# EAGLE design m328p_rfm69_node (EAGLE 7.2.0)
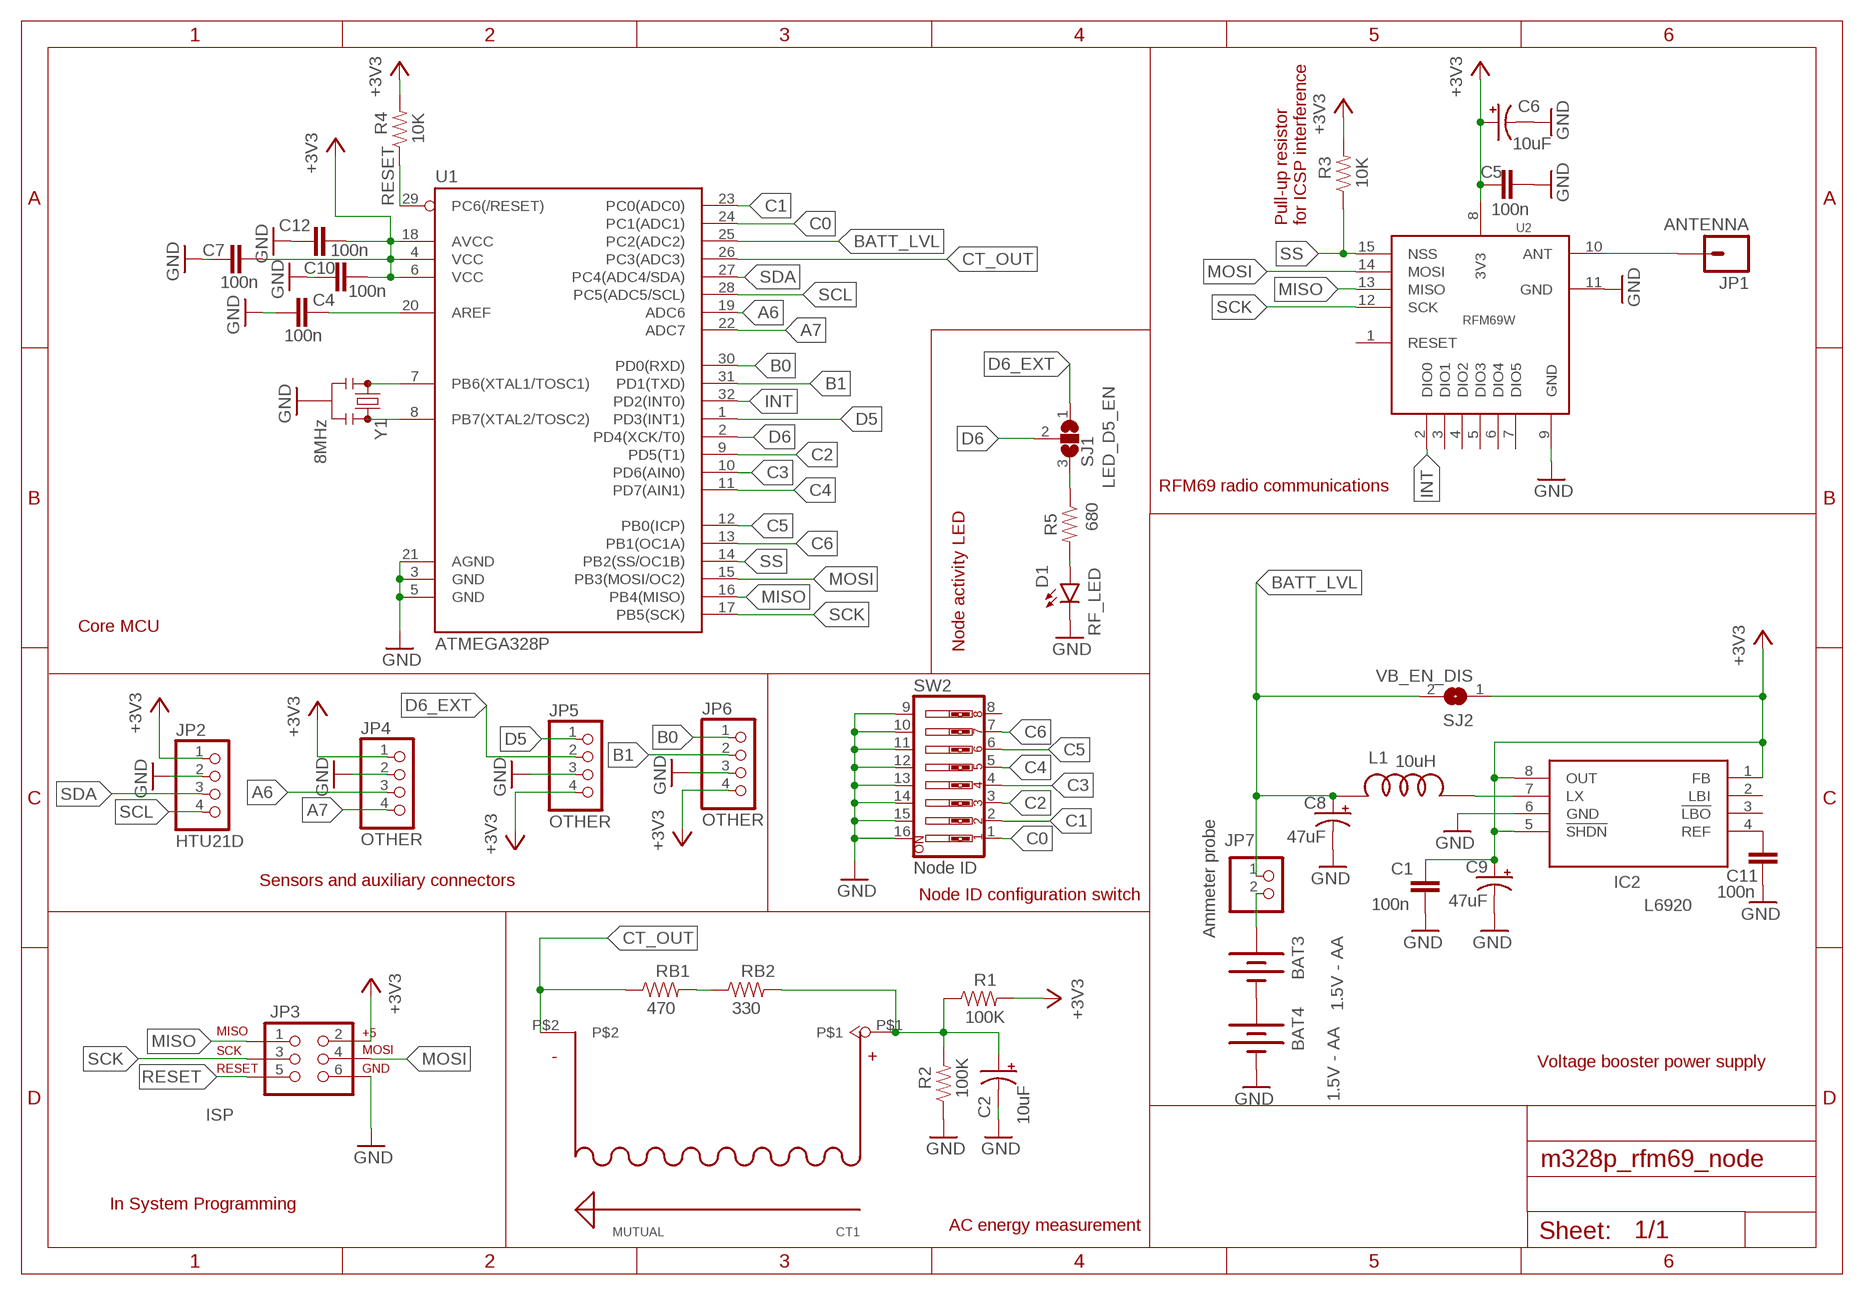
[diagram p0: schematic, sheet 1]

## Parts
BAT3  1.5V - AA  BATTERYAAA-KIT  [BATTERY-AAA-KIT]
BAT4  1.5V - AA  BATTERYAAA-KIT  [BATTERY-AAA-KIT]
C1  100n  CAP0805  [0805]
C2  10uF  47UF-TANT  [EIA3528]
C4  100n  CAP0805  [0805]
C5  100n  CAP0805  [0805]
C6  10uF  47UF-TANT  [EIA3528]
C7  100n  CAP0805  [0805]
C8  47uF  47UF-TANT  [EIA3528]
C9  47uF  47UF-TANT  [EIA3528]
C10  100n  CAP0805  [0805]
C11  100n  CAP0805  [0805]
C12  100n  CAP0805  [0805]
CT1  MUTUAL  [MUTUAL]
D1  RF_LED  LED0603  [LED-0603]
IC2  L6920  L6920TSSOP8  [TSSOP8]
JP1  ANTENNA  M01SMD  [LUXEON-PAD]
JP2  HTU21D  PINHD-1X4  [1X04]
JP3  ISP  AVR_SPI_PRG_6PTH  [2X3]
JP4  OTHER  PINHD-1X4  [1X04]
JP5  OTHER  PINHD-1X4  [1X04]
JP6  OTHER  PINHD-1X4  [1X04]
JP7  Ammeter probe  PINHD-1X2  [1X02]
L1  10uH  DLJ-4018  [DLJ-4018]
R1  100K  RESISTOR0805-RES  [0805]
R2  100K  RESISTOR0805-RES  [0805]
R3  10K  RESISTOR0805-RES  [0805]
R4  10K  RESISTOR0805-RES  [0805]
R5  680  RESISTOR0805-RES  [0805]
RB1  470  RESISTOR0805-RES  [0805]
RB2  330  RESISTOR0805-RES  [0805]
SJ1  LED_D5_EN  SJ2W  [SJ_2]
SJ2  VB_EN_DIS  SJ  [SJ]
SW2  Node ID  SW_DIP-8-SMT-HALFSIZE  [DIPSWITCH-08-50MIL]
U1  ATMEGA328P  ATMEGA328P_TQFP  [TQFP32-08]
U2  RFM69W  [RFM69W]
Y1  8MHz  RESONATOR4MHZ  [RESONATOR-SMD_MED]

## Nets
+3V3: C1.1 C5.1 C6.A(+) C7.2 C9.A(+) C10.2 C12.2 IC2.1(FB) IC2.5(!SHDN) IC2.8(OUT) JP2.1 JP3.2 JP4.1 JP5.4 JP6.4 R1.2 R3.2 R4.2 SJ2.1 U1.4(VCC) U1.6(VCC) U1.18(AVCC) U2.8(3V3)
A6: JP4.3 U1.19(ADC6)
A7: JP4.4 U1.22(ADC7)
B0: JP6.1 U1.30(PD0(RXD))
B1: JP6.2 U1.31(PD1(TXD))
BATT_LVL: C8.A(+) JP7.1 L1.P$2 SJ2.2 U1.25(PC2(ADC2))
C0: SW2.1 U1.24(PC1(ADC1))
C1: SW2.2 U1.23(PC0(ADC0))
C2: SW2.3 U1.9(PD5(T1))
C3: SW2.4 U1.10(PD6(AIN0))
C4: SW2.5 U1.11(PD7(AIN1))
C5: SW2.6 U1.12(PB0(ICP))
C6: SW2.7 U1.13(PB1(OC1A))
CT_OUT: CT1.P$2 RB1.1 U1.26(PC3(ADC3))
D5: JP5.1 U1.1(PD3(INT1))
D6: SJ1.2 U1.2(PD4(XCK/T0))
D6_EXT: JP5.2 SJ1.1
GND: BAT4.GND@1(-) C1.2 C2.C(-) C4.1 C5.2 C6.C(-) C7.1 C8.C(-) C9.C(-) C10.1 C11.2 C12.1 D1.C IC2.6(GND) JP2.2 JP3.6 JP4.2 JP5.3 JP6.3 R2.1 SW2.9 SW2.10 SW2.11 SW2.12 SW2.13 SW2.14 SW2.15 SW2.16 U1.3(GND) U1.5(GND) U1.21(AGND) U2.9(GND) U2.11(GND) Y1.2
INT: U1.32(PD2(INT0)) U2.2(DIO0)
MISO: JP3.1 U1.16(PB4(MISO)) U2.13(MISO)
MOSI: JP3.4 U1.15(PB3(MOSI/OC2)) U2.14(MOSI)
N$1: IC2.7(LX) L1.P$1
N$2: D1.A R5.2
N$3: RB1.2 RB2.1
N$4: C11.1 IC2.4(REF)
N$5: BAT3.PWR@1(+) JP7.2
N$6: U1.8(PB7(XTAL2/TOSC2)) Y1.3
N$8: BAT3.GND@1(-) BAT4.PWR@1(+)
N$9: U1.7(PB6(XTAL1/TOSC1)) Y1.1
N$10: JP1.P$1 U2.10(ANT)
N$11: C2.A(+) CT1.P$1 R1.1 R2.2 RB2.2
N$12: C4.2 U1.20(AREF)
N$13: R5.1 SJ1.3
RESET: JP3.5 R4.1 U1.29(PC6(/RESET))
SCK: JP3.3 U1.17(PB5(SCK)) U2.12(SCK)
SCL: JP2.4 U1.28(PC5(ADC5/SCL))
SDA: JP2.3 U1.27(PC4(ADC4/SDA))
SS: R3.1 U1.14(PB2(SS/OC1B)) U2.15(NSS)
Unconnected: IC2.2(LBI) IC2.3(!LBO) SW2.8 U2.1(RESET) U2.3(DIO1) U2.4(DIO2) U2.5(DIO3) U2.6(DIO4) U2.7(DIO5)

## Notes on the sheet
- Pull-up resistor
  for ICSP interference
- RFM69 radio communications
- Core MCU
- Node activity LED
- Sensors and auxiliary connectors
- Node ID configuration switch
- Voltage booster power supply
- In System Programming
- AC energy measurement

## Library data of the parts
BAT3 BAT4 = SparkFun-Electromechanical:BATTERY: Battery Holders Various common sizes : AA, AAA, 18650 (PRT-12895), 20mm coin cell and 12mm coin cell. 20MM_4LEGS, BATT-10373; PROD_ID: BATT-08571
C1 C4 C5 C7 C10-C12 = SparkFun-Capacitors:CAP: Capacitor Standard 0603 ceramic capacitor, and 0.1" leaded capacitor.
C2 C6 = SparkFun-Capacitors:47UF-TANT: 47uF Tantalum SMT CAP-08310- 10V 10% (EIA-3528); PROD_ID: CAP-08310; VALUE: 47uF
C8 C9 = SparkFun-Capacitors:47UF-TANT: 47uF Tantalum SMT CAP-08310- 10V 10% (EIA-3528); PROD_ID: CAP-08310
CT1 = Electricity_sensor:MUTUAL
D1 = SparkFun-LED:LED: LEDs Standard schematic elements and footprints for 5mm, 3mm, 1206, and 0603 sized LEDs. 5mm - Spark Fun Electronics SKU : COM-00529 (and others)
IC2 = l6920:L6920
JP1 = SparkFun-Connectors:M01: Header 1 Standard 1-pin 0.1" header. Use with straight break away headers (SKU : PRT-00116), right angle break away headers (PRT-00553), swiss pins (PRT-00743), machine pins (PRT-00117), and female headers (PRT-00115).
JP2 JP4-JP6 = pinhead:PINHD-1X4: PIN HEADER
JP3 = SparkFun-Connectors:AVR_SPI_PRG_6: AVR ISP 6 Pin This is the reduced ISP connector for AVR programming. Common on Arduino. This footprint will take up less PCB space and can be used with a 10-pin to 6-pin adapter such as SKU: BOB-08508 **Special note about "TEST_POINT" package. The stop mask is on the top side, so if you want your programming test points to be on the bottom of your board, make sure to place this package on the bottom side of the board. This also ensure that the orientation to program from the bottom side will be correct.
JP7 = pinhead:PINHD-1X2: PIN HEADER
L1 = dlj-4018:DLJ-4018
R1-R4 RB1 RB2 = SparkFun-Resistors:RESISTOR: Resistor Basic schematic elements and footprints for 0603, 1206, and PTH resistors.
R5 = SparkFun-Passives:RESISTOR: Resistor Basic schematic elements and footprints for 0603, 1206, and PTH resistors.
SJ1 = jumper:SJ2W: SMD solder JUMPER
SJ2 = jumper:SJ: SMD solder JUMPER
SW2 = SparkFun-Electromechanical:SW_DIP-8: DIP Switch 8 Position
U1 = SparkFun-DigitalIC:ATMEGA328P_TQFP; PROD_ID: IC-09069; VALUE: ATMEGA328P_TQFP
U2 = rfm69w:RFM69W: Radio Transceiver Module, FSK, 433, 848, 915 MHz, SPI controlled, Mfr=HopeRF
Y1 = SparkFun-FreqCtrl:RESONATOR: Resonator Small SMD resonator. Used, eg, on the Arduino Pro/ Pro Mini boards. 8MHz- XTAL-08895 16MHz- XTAL-08900; PROD_ID: XTAL-12492; VALUE: 4MHz

## Board
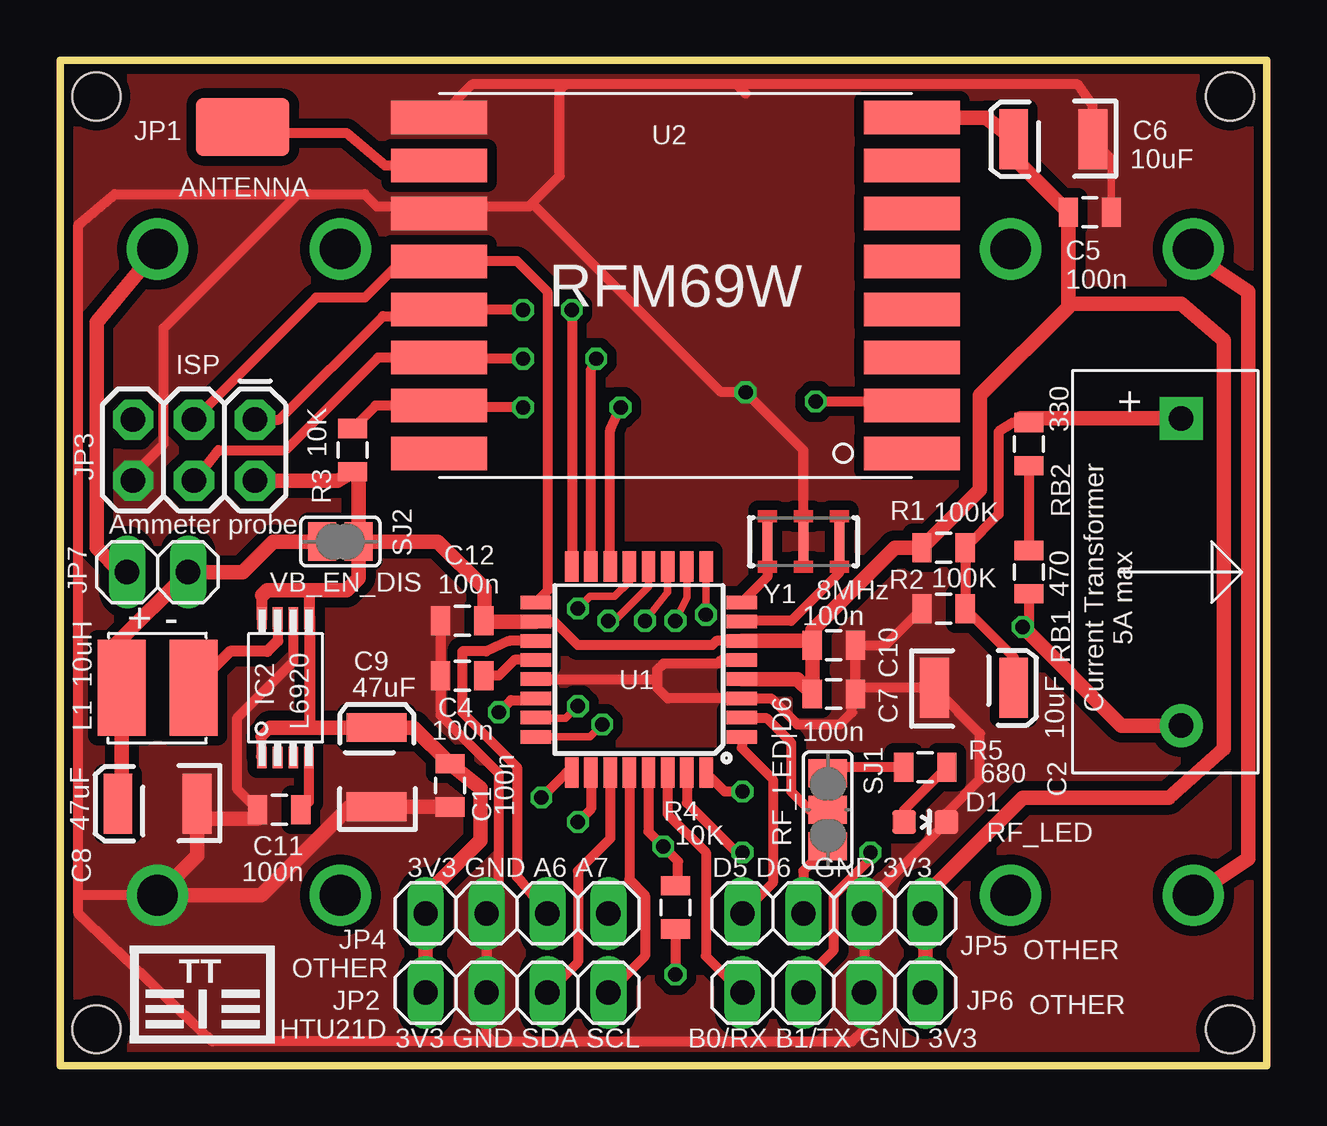
[diagram p1: board, top side]
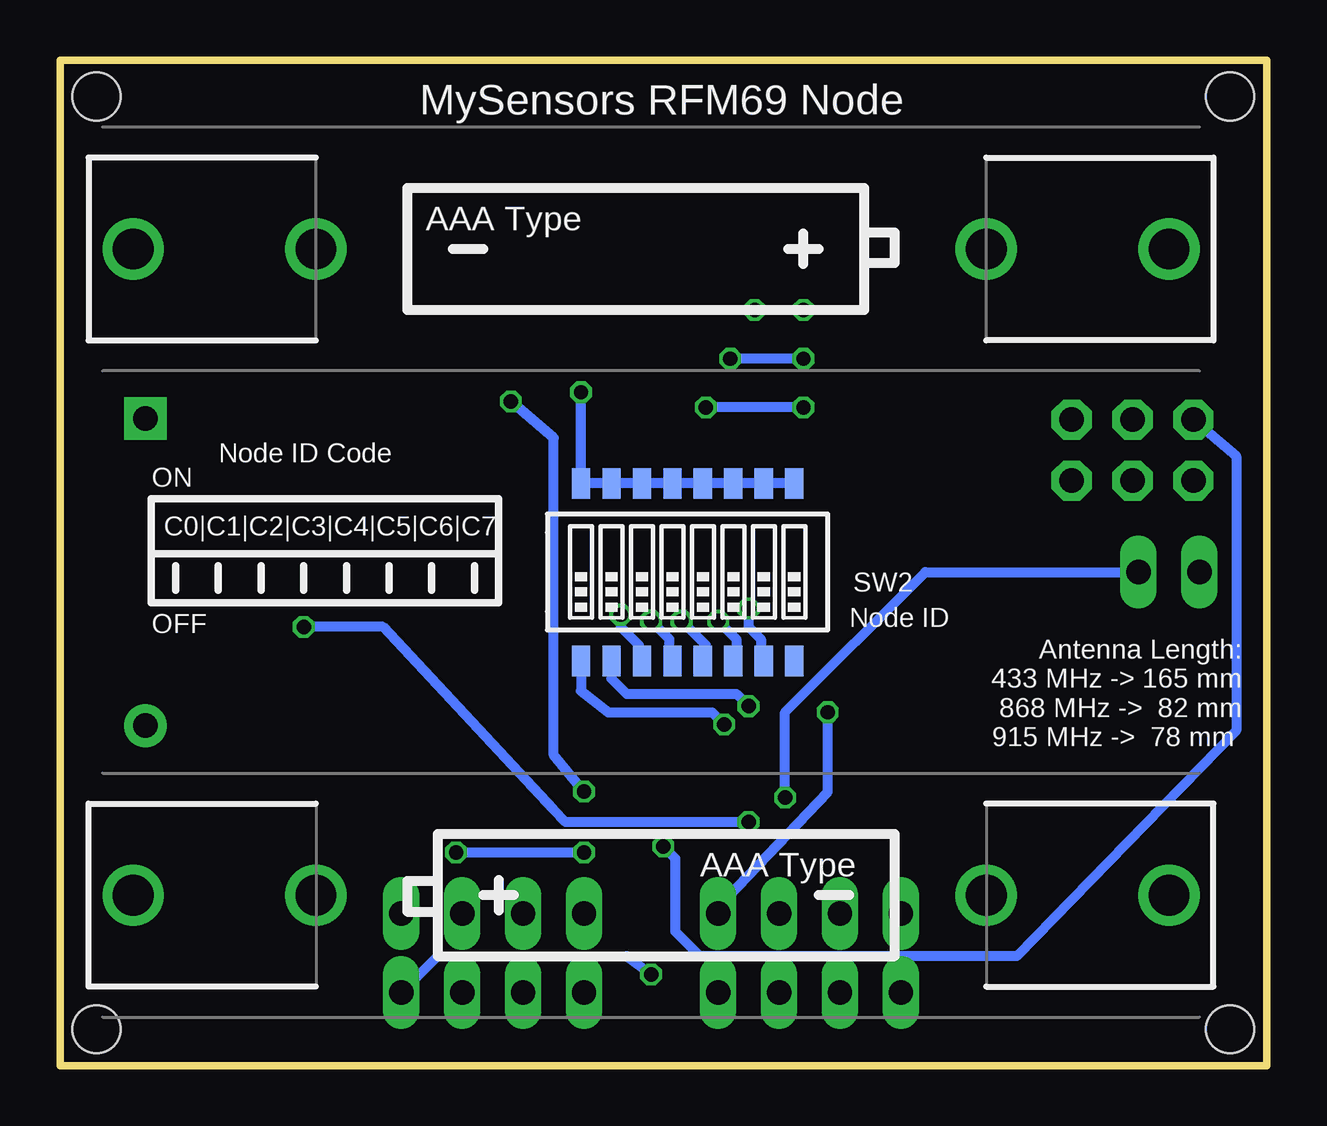
[diagram p2: board, bottom side, seen from below]

Size 50.29 x 41.91 mm. Coordinates in mm from the lower left corner, seen from the top.
Outline: 0,41.91 50.29,41.91 50.29,0 0,0 0,41.91
Copper layers (1*16): Top 0.035mm / dielectric 1.5mm / Bottom 0.035mm
Design rules "ITEADstudio_DRC *": minimum track width 6mil, minimum drill 12mil, track to track 6mil, track to pad 6mil, pad to pad 6mil, via to via 6mil, smd to smd 0mil, copper to edge 10mil, drill to drill 10mil, minimum pad ring 10mil, minimum via ring 6mil, stop-mask expansion 2mil, vias tented up to drill 100mil, thermal gap 10mil
Holes 2 mm at 1.52,40.39 1.52,1.52 48.77,1.52 48.77,40.39

### Footprints (pad centres in the part's own frame; a part is rotated, then mirrored left to right if it is on the bottom)
BATTERY-AAA-KIT = drill 1.702: GND@1 21.59,0; GND@2 13.97,0; PWR@1 -21.59,0; PWR@2 -13.97,0
0805 = smd 0.8 x 1.2: 1 -0.9,0; 2 0.9,0
EIA3528 = smd 1.2 x 2.5: A 1.65,0; C -1.65,0
MUTUAL = drill 1.016 pad 1.778 square: P$1 -6.4,0 | drill 1.016 pad 1.778: P$2 6.4,0
LED-0603 = smd 1 x 1: A 0,-0.877; C 0,0.877
TSSOP8 = smd 0.4 x 0.9: 1 -0.975,-2.9; 2 -0.325,-2.9; 3 0.325,-2.9; 4 0.975,-2.9; 5 0.975,2.9; 6 0.325,2.9; 7 -0.325,2.9; 8 -0.975,2.9
LUXEON-PAD = smd 3.9 x 2.4: P$1 0,0
1X04 = drill 1.016 long: 1 -3.81,0; 2 -1.27,0; 3 1.27,0; 4 3.81,0
2X3 = drill 1.016 pad 1.676 octagon: 1 -2.54,-1.27; 2 -2.54,1.27; 3 0,-1.27; 4 0,1.27; 5 2.54,-1.27; 6 2.54,1.27
1X02 = drill 1.016 long: 1 -1.27,0; 2 1.27,0
DLJ-4018 = smd 4 x 2: P$1 0,-1.5; P$2 0,1.5
SJ_2 = smd 1.168 x 1.6: 1 -1.524,0; 2 0,0; 3 1.524,0
SJ = smd 1.168 x 1.6: 1 -0.762,0; 2 0.762,0
DIPSWITCH-08-50MIL = smd 0.762 x 1.27: 1 -4.445,-3.7; 2 -3.175,-3.7; 3 -1.905,-3.7; 4 -0.635,-3.7; 5 0.635,-3.7; 6 1.905,-3.7; 7 3.175,-3.7; 8 4.445,-3.7; 9 4.445,3.7; 10 3.175,3.7; 11 1.905,3.7; 12 0.635,3.7; 13 -0.635,3.7; 14 -1.905,3.7; 15 -3.175,3.7; 16 -4.445,3.7
TQFP32-08 = smd 1.27 x 0.559: 1 -4.293,2.8; 2 -4.293,2; 3 -4.293,1.2; 4 -4.293,0.4; 5 -4.293,-0.4; 6 -4.293,-1.2; 7 -4.293,-2; 8 -4.293,-2.8; 17 4.293,-2.8; 18 4.293,-2; 19 4.293,-1.2; 20 4.293,-0.4; 21 4.293,0.4; 22 4.293,1.2; 23 4.293,2; 24 4.293,2.8 | smd 0.559 x 1.27: 9 -2.8,-4.293; 10 -2,-4.293; 11 -1.2,-4.293; 12 -0.4,-4.293; 13 0.4,-4.293; 14 1.2,-4.293; 15 2,-4.293; 16 2.8,-4.293; 25 2.8,4.293; 26 2,4.293; 27 1.2,4.293; 28 0.4,4.293; 29 -0.4,4.293; 30 -1.2,4.293; 31 -2,4.293; 32 -2.8,4.293
RFM69W = smd 4 x 1.4: 1 -9.85,7; 2 -9.85,5; 3 -9.85,3; 4 -9.85,1; 5 -9.85,-1; 6 -9.85,-3; 7 -9.85,-5; 8 -9.85,-7; 9 9.85,-7; 10 9.85,-5; 11 9.85,-3; 12 9.85,-1; 13 9.85,1; 14 9.85,3; 15 9.85,5; 16 9.85,7
RESONATOR-SMD_MED = smd 0.4 x 1.6: 1 -1.5,0; 2 0,0; 3 1.5,0

### Placement (x,y rotation side)
BAT3  25.65,34.04 180 bottom
BAT4  25.65,7.11 0 bottom
C1  16.26,11.68 270 top
C2  38.1,15.75 0 top
C4  16.76,16.26 0 top
C5  42.93,35.56 0 top
C6  41.4,38.61 180 top
C7  32.26,15.49 180 top
C8  4.06,10.92 180 top
C9  13.21,12.45 90 top
C10  32.26,17.53 180 top
C11  9.14,10.67 180 top
C12  16.76,18.54 0 top
CT1  46.74,20.57 270 top
D1  36.07,10.16 270 top
IC2  9.4,15.75 0 top
JP1  7.62,39.12 0 top
JP2  19.05,3.05 0 top
JP3  5.59,25.65 180 top
JP4  19.05,6.35 0 top
JP5  32.26,6.35 0 top
JP6  32.26,3.05 0 top
JP7  4.06,20.57 180 top
L1  4.06,15.75 90 top
R1  36.83,21.59 180 top
R2  36.83,19.05 0 top
R3  12.19,25.65 270 top
R4  25.65,6.6 270 top
R5  36.07,12.45 0 top
RB1  40.39,20.57 90 top
RB2  40.39,25.91 90 top
SJ1  32,10.67 90 top
SJ2  11.68,21.84 180 top
SW2  24.13,20.57 0 bottom
U1  24.13,16.51 180 top
U2  25.65,32.51 180 top
Y1  30.99,21.84 180 top

### Tracks (layer width: path | path; a pad name or v marks a point on that pad's centre or on a via)
+3V3  (via drill 0.6)
  Top 0.305: 17.7,18.51 C12.2 | 8.38,12.89 IC2.1 | 12.45,24.5 R3.2 | 10.41,14.35 10.16,14.1 | 10.41,18.69 IC2.5 | 31.36,18.15 C10.2 31.17,17.71 | 42.16,31.75 42.03,31.61
  Top 0.406: 8.38,13.72 8.38,12.89 | R4.2 v25.65,3.81 | U1.6 27.36,17.71 27.18,17.53 21.59,17.53 20.61,18.51 U1.18
  Top 0.457: 8.76,14.1 8.38,13.72 | IC2.8 8.42,19.6 | 10.41,14.35 10.41,18.69 10.41,19.81
  Top 0.61: U1.18 17.7,18.51 17.7,19.9 15.75,21.84 SJ2.1 | U1.4 30.74,16.11 C7.2 C10.2 | 8.76,14.1 10.16,14.1 C9.A 14.74,14.1 C1.1 17.53,11.57 17.53,9.4 15.24,7.11 JP4.1 JP2.1 | 8.42,19.6 8.64,19.81 10.41,19.81 11.94,19.81 12.45,20.32 SJ2.1 | SJ2.1 12.45,24.5 | JP3.2 11.57,24.38 R3.2 | 31.36,18.15 34.8,21.59 R1.2 38.35,24.01 38.35,27.94 42.03,31.61 C5.1 39.75,37.83 C6.A 38.59,39.51 U2.8 | 42.16,31.75 46.74,31.75 48.51,30.23 48.51,13.21 46.23,11.18 40.13,11.18 36.07,7.11 JP5.4 JP6.4 | U1.6 31.17,17.71
  Bottom 0.406: JP6.4 34.54,4.57 26.67,4.57 v25.65,3.81
A6
  Top 0.406: JP4.3 19.05,7.87 19.05,12.45 16.76,14.73 16.76,17.27 17.78,17.27 18.73,17.71 U1.19
A7  (via drill 0.6)
  Top 0.305: 19.77,15.24 U1.22
  Top 0.406: v18.29,14.73 18.8,15.24 19.77,15.24
  Bottom 0.406: JP4.4 22.86,6.6 18.29,11.43 v18.29,14.73
B0
  Top 0.406: JP6.1 26.92,4.57 26.92,8.89 25.33,10.48 U1.30
B1  (via drill 0.6)
  Top 0.406: U1.31 26.13,10.95 28.19,8.89 v28.45,8.89 28.45,9.14 | JP6.2 30.99,3.56 32.26,4.83 32.26,7.11 33.78,8.64 v33.78,8.89
  Bottom 0.406: v33.78,8.89 v28.45,8.89
BATT_LVL  (via drill 0.6)
  Top 0.406: U1.25 21.11,12.22 v20.07,11.18
  Top 0.61: SJ2.2 8.89,21.84 7.62,20.57 JP7.1 2.31,17.55 L1.P$2 2.56,11.07 C8.A 2.31,11.07
  Bottom 0.406: v20.07,11.18 20.07,14.73 14.22,20.57 JP7.1
C0  (via drill 0.6)
  Top 0.305: U1.24 22.1,13.72 v22.61,14.22
  Bottom 0.406: SW2.1 28.57,15.62 27.43,14.73 23.11,14.73 v22.61,14.22
C1  (via drill 0.6)
  Top 0.305: U1.23 19.87,14.48 21.08,14.48 v21.59,14.99
  Bottom 0.406: SW2.2 27.3,16.13 26.67,15.49 22.1,15.49 v21.59,14.99
C2  (via drill 0.6)
  Top 0.305: U1.9 26.93,19.06 v26.92,18.8
  Bottom 0.305: 26.16,17 SW2.3
  Bottom 0.406: v26.92,18.8 26.92,18.29 26.16,17.53 26.16,17
C3  (via drill 0.6)
  Top 0.305: U1.10 26.13,19.53 v25.65,18.54
  Bottom 0.305: 24.89,17 SW2.4
  Bottom 0.406: 24.89,17 24.89,17.78 v25.65,18.54
C4  (via drill 0.6)
  Top 0.305: U1.11 25.33,19.74 v24.38,18.54
  Bottom 0.305: 23.37,17 SW2.5
  Bottom 0.406: 23.37,17 23.37,17.53 v24.38,18.54
C5  (via drill 0.6)
  Top 0.305: U1.12 24.53,19.96 23.11,18.54 v22.86,18.54
  Bottom 0.305: 22.1,17 SW2.6
  Bottom 0.406: v22.86,18.54 22.1,17.78 22.1,17
C6  (via drill 0.6)
  Top 0.305: U1.13 23.73,20.17 23.11,19.56 22.1,19.56 v21.59,19.05
  Bottom 0.305: 21.08,17 SW2.7
  Bottom 0.406: v21.59,19.05 21.59,18.29 21.08,17.78 21.08,17
CT_OUT  (via drill 0.6)
  Top 0.305: 40.39,18.54 v40.13,18.29
  Top 0.406: U1.26 22.13,10.7 v21.59,10.16 | RB1.1 40.39,18.54
  Top 0.61: CT1.P$2 44.25,14.17 v40.13,18.29
  Bottom 0.406: v40.13,18.29 36.83,18.29 29.72,10.67 29.21,10.16 v21.59,10.16
D5
  Top 0.406: U1.1 28.42,13.23 29.72,11.94 29.72,7.62 JP5.1
D6
  Top 0.406: SJ1.2 31.24,10.67 30.48,11.43 30.48,13.46 29.46,14.48 28.45,14.48 U1.2
D6_EXT
  Top 0.406: SJ1.1 30.99,8.13 JP5.2
GND  (via drill 0.6)
  Top 0.254: JP3.6 3.05,24.64 | 9.91,36.32 10.41,36.32
  Top 0.305: 15.76,10.8 C1.2 | C11.2 8.24,10.3 | 14.74,35.81 U2.11 16.01,35.81 | 24.78,16.11 24.89,16 | D1.C 36.95,10.53 | 33.41,15.75 C7.1 33.02,15.36 | C5.2 43.83,37.83 C6.C
  Top 0.406: C12.1 C4.1 15.86,14.62 18.29,12.19 18.29,6.86 JP4.2 JP2.2 17.78,1.27 18.03,1.02 | C7.1 C10.1 34.41,17.53 R2.1 | IC2.6 9.72,16.84 7.37,14.48 7.37,11.55 C11.2 | 14.74,35.81 13.21,35.81 12.7,36.32 10.41,36.32 2.29,36.32 0.76,35.05 0.76,7.11 | U1.21 24.78,16.11 | D1.C 33.53,6.74 JP5.3 JP6.3 33.53,1.52 33.02,1.02 18.03,1.02 | 36.95,10.53 38.35,11.94 38.35,13.84 C2.C 33.41,15.75 | 33.02,15.36 33.02,14.73 32.51,14.22 30.73,14.22 29.65,15.31 U1.3 25.33,15.31 24.89,15.75 24.89,16 24.89,16.51 25.15,16.76 27.43,16.76 27.58,16.91 U1.5 | C6.C 43.05,40.01 42.42,40.89 28.19,40.89 | 28.19,40.89 21.08,40.89 | 21.08,40.89 17.19,40.89 U2.9 | Y1.2 30.99,25.65 v28.57,28.07 27.56,28.07 19.68,35.94 | 3.05,24.64 4.32,25.91 4.32,30.73 9.91,36.32 | 18.03,1.02 6.35,1.02 0.76,6.35 0.76,7.11 | C9.C 12.32,10.8 | 28.57,40.51 28.19,40.89 | 16.01,35.81 19.56,35.81 19.68,35.94 | 19.68,35.94 20.83,37.08 20.83,40.64 21.08,40.89 | BAT4.GND@1 0.76,7.11
  Top 0.61: C9.C 15.76,10.8 | C8.C 5.71,10.41 | 5.71,10.41 5.71,8.76 BAT4.GND@1 8.38,7.11 12.07,10.8 12.32,10.8 | 8.24,10.3 5.83,10.3 5.71,10.41
  Bottom 0.406: SW2.9 SW2.10 SW2.11 SW2.12 SW2.13 SW2.14 SW2.15 SW2.16 v28.57,28.07
  pour Top (isolate 0.406, no thermals): 0,41.91 50.29,41.91 50.29,0 0,0
INT  (via drill 0.6)
  Top 0.305: 34.92,27.69 U2.2
  Top 0.406: v31.5,27.69 34.92,27.69 | v28.45,11.43 27.72,11.43 U1.32
  Bottom 0.406: v28.45,11.43 29.72,12.95 29.72,26.16 v31.5,27.69
MISO  (via drill 0.6)
  Top 0.305: 16.07,31.5 U2.13 | U1.16
  Top 0.406: v19.3,31.5 16.07,31.5 | v21.34,31.5 U1.16 | JP3.1 9.14,26.92 13.46,31.24 15.53,31.24 U2.13
  Bottom 0.406: v21.34,31.5 v19.3,31.5
MOSI  (via drill 0.6)
  Top 0.305: 15.85,29.46 U2.14
  Top 0.406: JP3.4 6.6,25.65 9.4,25.65 13.26,29.51 U2.14 | v19.3,29.46 15.85,29.46 | U1.15 22.13,28.99 v22.35,29.46
  Bottom 0.406: v19.3,29.46 v22.35,29.46
N$1
  Top 0.406: IC2.7 9.07,17.71
  Top 0.457: L1.P$1 7.09,17.27 8.64,17.27 9.07,17.71
N$2
  Top 0.406: D1.A 35.19,10.67 R5.2
N$3
  Top 0.406: RB2.1 RB1.2
N$4
  Top 0.406: IC2.4 10.37,11 C11.1
N$5
  Top 0.305: JP7.2 2.54,20.57
  Top 0.61: 2.54,20.57 1.52,21.59 1.52,30.99 BAT3.PWR@1
N$6
  Top 0.406: Y1.3 29.49,20.38 U1.8
N$8
  Top 0.305: BAT3.GND@1 47.24,33.78
  Top 0.61: 47.24,33.78 49.53,32.26 49.53,8.64 BAT4.PWR@1
N$9
  Top 0.305: 28.45,18.54 U1.7
  Top 0.406: Y1.1 32.49,20.55 30.48,18.54 28.45,18.54
N$10
  Top 0.305: 7.87,38.86 JP1.P$1
  Top 0.406: U2.10 13.54,37.51 11.94,38.86 7.87,38.86
N$11
  Top 0.305: 40.04,26.97 RB2.2 39.76,26.81 | C2.A 39.75,17.03
  Top 0.406: 39.75,17.03 R2.2 R1.1 39.12,22.98 39.12,26.42 39.76,26.81
  Top 0.61: CT1.P$1 40.04,26.97
N$12
  Top 0.406: U1.20 18.94,16.91 18.29,16.26 C4.2
N$13
  Top 0.305: 32,12.45 SJ1.3
  Top 0.406: R5.1 32,12.45
RESET  (via drill 0.6)
  Top 0.406: U1.29 24.53,9.76 v25.15,9.14 25.77,8.52 25.77,7.5 R4.1
  Bottom 0.406: JP3.5 1.27,25.4 1.27,13.97 10.41,4.57 23.62,4.57 24.64,5.59 24.64,8.64 v25.15,9.14
SCK
  Top 0.305: 16.33,33.53 U2.12
  Top 0.406: 16.33,33.53 19.05,33.53 20.32,32.26 20.32,19.79 U1.17 | JP3.3 10.67,32 12.7,32 14.21,33.51 U2.12
SCL
  Top 0.406: U1.28 23.73,7.77 24.38,7.11 24.38,4.57 JP2.4
SDA
  Top 0.406: U1.27 22.93,9.47 21.59,8.13 21.59,4.32 JP2.3
SS  (via drill 0.6)
  Top 0.305: 15.88,27.43 U2.15
  Top 0.406: U2.15 13.15,27.51 R3.1 | v19.3,27.43 15.88,27.43 | U1.14 22.93,26.49 v23.37,27.43
  Bottom 0.406: v19.3,27.43 v23.37,27.43

### Text on the board
tPlace: + - | Current Transformer / 5A max | RF_LED|D6 | 3V3 GND A6 A7 | D5 D6 GND 3V3 | TT | 3V3 GND SDA SCL | B0/RX B1/TX GND 3V3
bPlace: MySensors RFM69 Node | AAA Type | Node ID Code | ON | C0|C1|C2|C3|C4|C5|C6|C7 | Antenna Length: / 433 MHz -> 165 mm / 868 MHz -> 82 mm / 915 MHz -> 78 mm | OFF | AAA Type